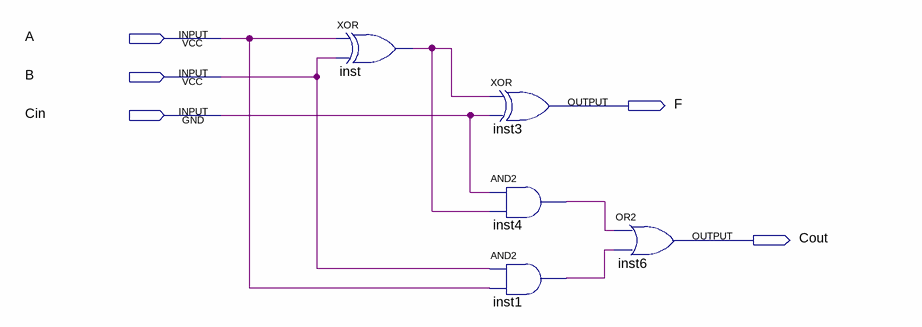
[diagram p0: schematic sheet]
// Quartus schematic FullAdder.bdf as structural Verilog: 5 symbols, 5 pins
module FullAdder (
  input  A,
  input  B,
  input  Cin,
  output F,
  output Cout
);

  wire inst1_out, inst4_out, inst_out;

  xor inst (inst_out, A, B);
  xor inst3 (F, inst_out, Cin);
  and inst4 (inst4_out, Cin, inst_out);
  and inst1 (inst1_out, B, A);
  or inst6 (Cout, inst4_out, inst1_out);
endmodule
